# Altium schematic sheet P03_Power Supplies.SchDoc
size C; SheetNumber: 3; SheetTotal: 6
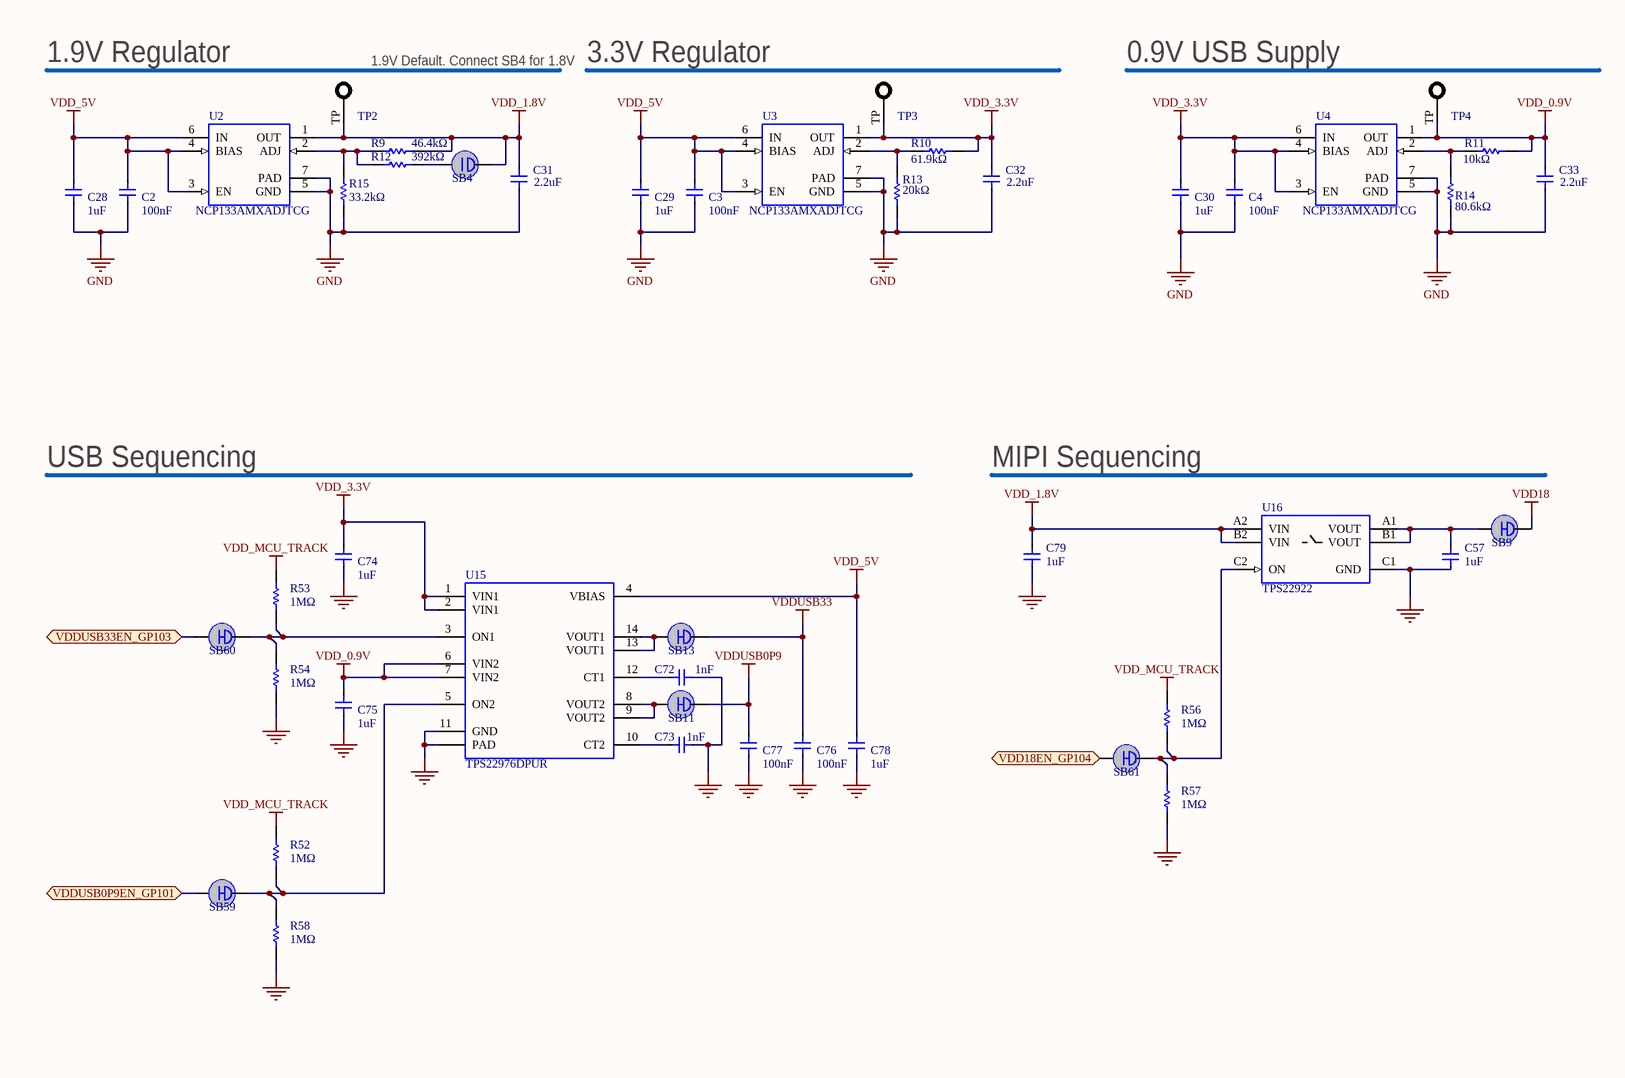
[diagram p0: P03_Power Supplies.SchDoc, left]
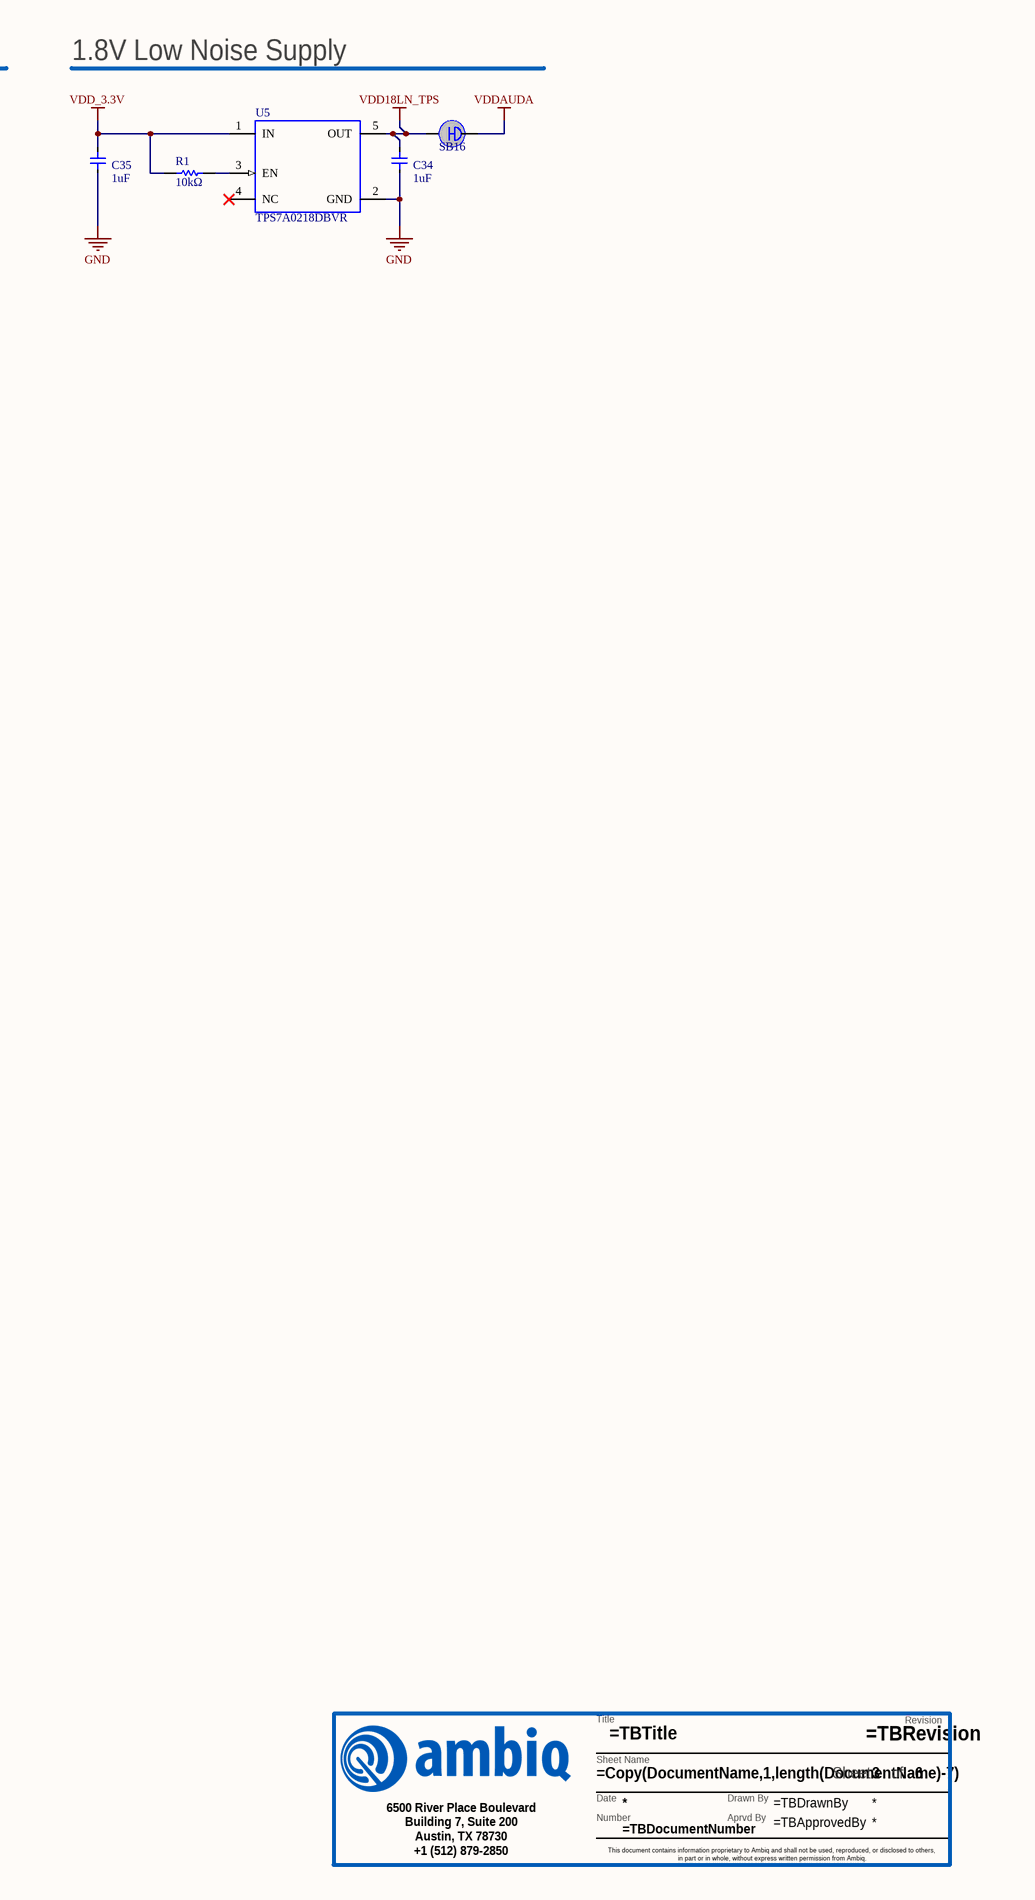
[diagram p1: P03_Power Supplies.SchDoc, right]

## Parts
?  TitleBlock  (value not drawn)  (graphical)
C2  100nF  [IPC_C]
C3  100nF  [IPC_C]
C4  100nF  [IPC_C]
C28  1uF  [IPC_C]
C29  1uF  [IPC_C]
C30  1uF  [IPC_C]
C31  2.2uF  [IPC_C]
C32  2.2uF  [IPC_C]
C33  2.2uF  [IPC_C]
C34  1uF  [IPC_C]
C35  1uF  [IPC_C]
C57  1uF  [IPC_A]
C72  1nF  [IPC_C]
C73  1nF  [IPC_C]
C74  1uF  [IPC_C]
C75  1uF  [IPC_C]
C76  100nF  [IPC_C]
C77  100nF  [IPC_C]
C78  1uF  [IPC_C]
C79  1uF  [IPC_A]
R1  10kΩ  [IPC_C]
R9  46.4kΩ  [IPC_C]
R10  61.9kΩ  [IPC_C]
R11  10kΩ  [IPC_C]
R12  392kΩ  [IPC_C]
R13  20kΩ  [IPC_C]
R14  80.6kΩ  [IPC_C]
R15  33.2kΩ  [IPC_C]
R52  1MΩ  [IPC_C]
R53  1MΩ  [IPC_C]
R54  1MΩ  [IPC_C]
R56  1MΩ  [IPC_C]
R57  1MΩ  [IPC_C]
R58  1MΩ  [IPC_C]
SB4  SBO  [SB39X18]  (value not drawn)  (no BOM)
SB9  Solder short  [SB39X18_SHORTED]  (value not drawn)  (net tie, no BOM)
SB11  Solder short  [SB39X18_SHORTED]  (value not drawn)  (net tie, no BOM)
SB13  Solder short  [SB39X18_SHORTED]  (value not drawn)  (net tie, no BOM)
SB16  SBS  [SB39X18_SHORTED]  (value not drawn)  (net tie, no BOM)
SB59  Solder short  [SB39X18_SHORTED]  (value not drawn)  (net tie, no BOM)
SB60  Solder short  [SB39X18_SHORTED]  (value not drawn)  (net tie, no BOM)
SB61  Solder short  [SB39X18_SHORTED]  (value not drawn)  (net tie, no BOM)
TP2  Blue Ring  [5117]  (value not drawn)
TP3  Blue Ring  [5117]  (value not drawn)
TP4  Blue Ring  [5117]  (value not drawn)
U2  NCP133AMXADJTCG  [SON40P120X45_HS-7N]
U3  NCP133AMXADJTCG  [SON40P120X45_HS-7N]
U4  NCP133AMXADJTCG  [SON40P120X45_HS-7N]
U5  TPS7A0218DBVR  [SOT95P280X145-5N]
U15  TPS22976DPUR  [R-PWSON50P300x200-N14]
U16  TPS22922  [BGA6C50P2X3_90X140X55]

## Ports
VDD18EN_GP104 (bidir), VDDUSB0P9EN_GP101 (bidir), VDDUSB33EN_GP103 (bidir)

## Nets
GND: C2.2 C3.2 C4.2 C28.2 C29.2 C30.2 C31.2 C32.2 C33.2 C34.2 C35.2 C57.2 C72.2 C73.2 C74.2 C75.2 C76.2 C77.2 C78.2 C79.2 R13.2 R14.1 R15.1 R54.1 R57.1 R58.1 U2.5(GND) U2.7(PAD) U3.5(GND) U3.7(PAD) U4.5(GND) U4.7(PAD) U5.2(GND) U15.11(GND) U15.PAD U16.C1(GND)
VDD18: SB9.2
VDD18LN_TPS: C34.1 SB16.1 U5.5(OUT)
VDD_0.9V: C33.1 C75.1 R11.2 TP4.TP U4.1(OUT) U15.6(VIN2) U15.7(VIN2)
VDD_1.8V: C31.1 C79.1 R9.2 SB4.2 TP2.TP U2.1(OUT) U16.A2(VIN) U16.B2(VIN)
VDD_3.3V: C4.1 C30.1 C32.1 C35.1 C74.1 R1.2 R10.2 TP3.TP U3.1(OUT) U4.3(EN) U4.4(BIAS) U4.6(IN) U5.1(IN) U15.1(VIN1) U15.2(VIN1)
VDD_5V: C2.1 C3.1 C28.1 C29.1 C78.1 U2.3(EN) U2.4(BIAS) U2.6(IN) U3.3(EN) U3.4(BIAS) U3.6(IN) U15.4(VBIAS)
VDD_MCU_TRACK: R52.2 R53.2 R56.2
VDDAUDA: SB16.2
VDDUSB0P9: C77.1 SB11.2
VDDUSB33: C76.1 SB13.2
VDD18EN_GP104: SB61.1 ; port VDD18EN_GP104
VDDUSB0P9EN_GP101: SB59.1 ; port VDDUSB0P9EN_GP101
VDDUSB33EN_GP103: SB60.1 ; port VDDUSB33EN_GP103
NetC57_1: C57.1 SB9.1 U16.A1(VOUT) U16.B1(VOUT)
NetC72_1: C72.1 U15.12(CT1)
NetC73_1: C73.1 U15.10(CT2)
NetR1_1: R1.1 U5.3(EN)
NetR9_1: R9.1 R12.2 R15.2 U2.2(ADJ)
NetR10_1: R10.1 R13.1 U3.2(ADJ)
NetR11_1: R11.1 R14.2 U4.2(ADJ)
NetR12_1: R12.1 SB4.1
NetR52_1: R52.1 R58.2 SB59.2 U15.5(ON2)
NetR53_1: R53.1 R54.2 SB60.2 U15.3(ON1)
NetR56_1: R56.1 R57.2 SB61.2 U16.C2(ON)
NetSB11_1: SB11.1 U15.8(VOUT2) U15.9(VOUT2)
NetSB13_1: SB13.1 U15.13(VOUT1) U15.14(VOUT1)

Not connected (* = marked no-connect by the designer): U5 4(NC)*

## Notes on the sheet
- 1.9V Regulator
- (near TP2) 1.9V Default. Connect SB4 for 1.8V
- 3.3V Regulator
- 0.9V USB Supply
- 1.8V Low Noise Supply
- USB Sequencing
- MIPI Sequencing
- (in symbol TitleBlock) Revision; Title; Sheet Name; Sheet; of; Date; Drawn By; Number; Aprvd By; 6500 River Place Boulevard / Building 7, Suite 200 / Austin, TX 78730 / +1 (512) 879-2850; This document contains information proprietary to Ambiq and shall not be used, reproduced, or disclosed to others, / in part or in whole, without express written permission from Ambiq.

## Library data of the parts
? = TitleBlock: Title block for Ambiq Schematics. Please have the following parameters entered in Project>Project Options>Parameters: / TBTitle / TBDocumentNumber / TBRevision / TBDrawnBy / TBApprovedBy; AMBIQ PN: TitleBlock
C2-C4 C76 C77 = 0201ZD104KAT2A: NONE; Manufacturer: Kyocera AVX; Tolerance: 10%; Voltage Rating: 10V; AMBIQ PN: 0201ZD104KAT2A; Supplier 1: Arrow Electronics; Supplier Part Number 1: 0201ZD104KAT2A; Manufacturer Part Number: 0201ZD104KAT2A; RoHS: Yes; Category: Ceramic Capacitors; Stock 1: 105000; Pricing 1: 15000=0.00770, 30000=0.00750, 45000=0.00740, 60000=0.00720, 75000=0.00690, 150000=0.00620 (USD); Mount: Surface Mount; Case/Package: 0201; Case Code (Metric): 0603; Case Code (Imperial): 0201; Min Operating Temperature: -55°C; Max Operating Temperature: 85°C; Capacitance: 100nF; Packaging: Tape and Reel; Voltage Rating (DC): 10V; Series: -; Lead Free: Lead Free; RoHS Compliant: Yes; ComponentLink1URL: http://www.mouser.com/ds/2/40/cx5r-776519.pdf?src-supplier=Mouser; ComponentLink1Description: http://www.mouser.com/ds/2/40/cx5r-776519.pdf?src-supplier=Mouser
C28-C30 C34 C35 C74 C75 C78 = CL05A105MP5NNNC: NONE; Manufacturer: Samsung; Tolerance: 20%; Voltage Rating: 10V; Dielectric: X5R; AMBIQ PN: CL05A105MP5NNNC; Supplier 1: Newark; Supplier Part Number 1: 82AC9187; Manufacturer Part Number: CL05A105MP5NNNC; RoHS: Yes; Category: Ceramic Capacitors; Pricing 1: 50000=0.10000 (USD); Mount: Surface Mount; Case/Package: 0402; Case Code (Metric): 1005; Case Code (Imperial): 0402; Min Operating Temperature: -55°C; Max Operating Temperature: 85°C; Capacitance: 1uF; Packaging: Tape and Reel; Voltage Rating (DC): 10V; Series: CL; Construction: Flat; Length: 1mm; Width: 0.02inch; Height: 0.5mm; Thickness: 0.022inch; Depth: 0.5mm; Radiation Hardening: No; Lead Free: Lead Free; RoHS Compliant: Yes; ComponentLink1URL: https://datasheet.ciiva.com/25802/cl05a105mp5nnnc-25802049.pdf?src-supplier=Digi-Key; ComponentLink1Description: https://datasheet.ciiva.com/25802/cl05a105mp5nnnc-25802049.pdf?src-supplier=Digi-Key; Package Quantity: 1
C31-C33 = CL05A225KP5NNNC: NONE; Manufacturer: Samsung; Tolerance: 10%; Voltage Rating: 10V; AMBIQ PN: CL05A225KP5NNNC; Supplier 1: Arrow Electronics; Supplier Part Number 1: CL05A225KP5NNNC; Manufacturer Part Number: CL05A225KP5NNNC; RoHS: Yes; Category: Ceramic Capacitors; Stock 1: 32414; Pricing 1: 1=0.14620, 10=0.09980, 25=0.09880, 100=0.05200, 250=0.05150, 500=0.03630, 1000=0.02990, 3000=0.02760, 6000=0.02610, 15000=0.023; Mount: Surface Mount; Case/Package: 0402; Case Code (Metric): 1005; Case Code (Imperial): 0402; Min Operating Temperature: -55°C; Max Operating Temperature: 85°C; Capacitance: 2.2uF; Packaging: Tape and Reel; Voltage Rating (DC): 10V; Series: CL; Length: 0.039inch; Width: 0.02inch; Thickness: 0.022inch; RoHS Compliant: Yes; ComponentLink1URL: https://datasheet.ciiva.com/25727/cl05a225kp5nnnc-25727777.pdf?src-supplier=Digi-Key; ComponentLink1Description: https://datasheet.ciiva.com/25727/cl05a225kp5nnnc-25727777.pdf?src-supplier=Digi-Key; Package Quantity: 1
C57 C79 = GRM033R61A105ME15D: NONE; Manufacturer: Murata; Tolerance: 20%; Voltage Rating: 10V; Dielectric: X5R; AMBIQ PN: GRM033R61A105ME15D; Supplier 1: Arrow Electronics; Supplier Part Number 1: GRM033R61A105ME15D; Manufacturer Part Number: GRM033R61A105ME15D; RoHS: Yes; Category: Ceramic Capacitors; Stock 1: 387591; Pricing 1: 1=0.35440, 10=0.26860, 25=0.26600, 50=0.24050, 100=0.18220, 250=0.18020, 500=0.17800, 1000=0.12040, 3000=0.11920, 6000=0.08160,; Mount: Surface Mount; Case/Package: 0201; Case Code (Metric): 0603; Case Code (Imperial): 0201; Min Operating Temperature: -55°C; Max Operating Temperature: 85°C; Capacitance: 1uF; Packaging: Tape and Reel; Voltage Rating (DC): 10V; Length: 0.024inch; Width: 0.012inch; Thickness: 0.015inch; RoHS Compliant: Yes; ComponentLink1URL: http://search.murata.co.jp/Ceramy/image/img/A01X/G101/ENG/GRM033R61A105ME15-01.pdf?src-supplier=Digi-Key; ComponentLink1Description: http://search.murata.co.jp/Ceramy/image/img/A01X/G101/ENG/GRM033R61A105ME15-01.pdf?src-supplier=Digi-Key
C72 C73 = GRM1555C1H102JA01D: NONE; Manufacturer: Murata; Tolerance: 5%; Voltage Rating: 50V; Dielectric: C0G; Dielectric Material: Ceramic; Insulation Resistance: 10GR; Temperature Coefficient: 30ppm/°C; AMBIQ PN: GRM1555C1H102JA01D; Supplier 1: Arrow Electronics; Supplier Part Number 1: GRM1555C1H102JA01D; Manufacturer Part Number: GRM1555C1H102JA01D; RoHS: Yes; Category: Ceramic Capacitors; Stock 1: 3380000; Pricing 1: 10000=0.00710, 20000=0.00680, 30000=0.00660, 50000=0.00590, 100000=0.00470 (USD); Mount: Surface Mount; Case/Package: 0402; Case Code (Metric): 1005; Case Code (Imperial): 0402; Min Operating Temperature: -55°C; Max Operating Temperature: 125°C; Capacitance: 1nF; Packaging: Tape and Reel; Voltage: 50V; Voltage Rating (DC): 50V; Series: GRM; Construction: Flat; Length: 1mm; Width: 0.5mm; Height: 0.5mm; Thickness: 0.022inch; Depth: 0.5mm; Radiation Hardening: No; REACH SVHC: No SVHC; Lead Free: Lead Free; RoHS Compliant: Yes; ComponentLink1URL: https://datasheet.ciiva.com/34302/1855908-34302849.pdf?src-supplier=Jameco; ComponentLink1Description: https://datasheet.ciiva.com/34302/1855908-34302849.pdf?src-supplier=Jameco; Package Quantity: 1; Termination: SMD/SMT; Number of Pins: 2; Material: Ceramic; Size: 0.5mm
R1 R11 = RC0402FR-0710KL: Surface Mount Thick Film Resistor, Rc Series, 10 Kohm, 62.5 Mw, - 1%, 50 V, 0402 [1005 Metric]; Manufacturer: Yageo; Resistance: 10kR; Power Rating: 62.5mW; Voltage Rating: 50V; Max Power Dissipation: 63mW; Temperature Coefficient: 100ppm/°C; AMBIQ PN: RC0402FR-0710KL; Supplier 1: Arrow Electronics; Supplier Part Number 1: RC0402FR-0710KL; Manufacturer Part Number: RC0402FR-0710KL; RoHS: Yes; Category: Chip SMD Resistors; Stock 1: 7776428; Pricing 1: 10000=0.00210 (USD); Case/Package: 0402; Case Code (Metric): 1005; Case Code (Imperial): 0402; Min Operating Temperature: -55°C; Max Operating Temperature: 155°C; Packaging: Tape and Reel; Resistor Type: Thick Film; Number of Terminations: 2; Termination: SMD/SMT; Voltage Rating (DC): 50V; Features: Moisture Resistant; Series: RC; Construction: Rectangular; Length: 1mm; Width: 0.5mm; Height: 0.32mm; Depth: 0.5mm; REACH SVHC: No SVHC; Military Standard: Not; Lead Free: Lead Free; RoHS Compliant: Yes; ComponentLink1URL: https://datasheet.ciiva.com/7660/38568-7660787.pdf?src-supplier=Element14; ComponentLink1Description: https://datasheet.ciiva.com/7660/38568-7660787.pdf?src-supplier=Element14; ComponentLink2URL: https://datasheet.ciiva.com/7849/1686128-7849814.pdf?src-supplier=Element14; ComponentLink2Description: https://datasheet.ciiva.com/7849/1686128-7849814.pdf?src-supplier=Element14; ComponentLink3URL: https://datasheet.ciiva.com/7983/1018594-7983486.pdf?src-supplier=Element14; Tolerance: 1%; Number of Pins: 2; Resistance Tolerance: 1%; Working Voltage: 50V; Lead Pitch: 0.2mm
R9 = ERJ-2RKF4642X: Res Thick Film 0402 46.4K Ohm 1% 1/10W ±100ppm/°C Molded SMD Punched Carrier T/R; Manufacturer: Panasonic; Resistance: 46.4kR; Power Rating: 100mW; Voltage Rating: 50V; AMBIQ PN: ERJ-2RKF4642X; Supplier 1: Arrow Electronics; Supplier Part Number 1: ERJ-2RKF4642X; Manufacturer Part Number: ERJ-2RKF4642X; RoHS: Yes; Category: Chip SMD Resistors; Stock 1: 70000; Pricing 1: 10000=0.00520 (USD); Mount: Surface Mount; Case/Package: 0402; Case Code (Metric): 1005; Case Code (Imperial): 0402; Contact Plating: Tin; Min Operating Temperature: -55°C; Max Operating Temperature: 155°C; Package Quantity: 1; Packaging: Tape and Reel; Resistor Type: Thick Film; Number of Terminations: 2; Termination: SMD/SMT; Max Power Dissipation: 100mW; Temperature Coefficient: 100ppm/°C; Voltage Rating (DC): 50V; Features: Automotive AEC-Q200; Series: ERJ; Technology: THICK FILM; Construction: Rectangular; Length: 1mm; Width: 0.02inch; Height: 0.35mm; Depth: 0.5mm; Radiation Hardening: No; REACH SVHC: Yes; Military Standard: Not; Lead Free: Lead Free; RoHS Compliant: Yes; ComponentLink1URL: https://datasheet.ciiva.com/7870/aoa0000ce2-7870821.pdf?src-supplier=Element14; ComponentLink1Description: https://datasheet.ciiva.com/7870/aoa0000ce2-7870821.pdf?src-supplier=Element14; ComponentLink2URL: https://datasheet.ciiva.com/43467/1678782-43467454.pdf?src-supplier=Farnell; ComponentLink2Description: https://datasheet.ciiva.com/43467/1678782-43467454.pdf?src-supplier=Farnell; ComponentLink3URL: https://datasheet.ciiva.com/46372/1678782-46372975.pdf?src-supplier=Element14; Tolerance: 1%; Resistance Tolerance: 1%
R10 = ERJ-2RKF6192X: Res Thick Film 0402 61.9K Ohm 1% 1/10W +/-100ppm/ßC Molded SMD Punched Carrier T/R; Manufacturer: Panasonic; Resistance: 61.9kR; Power Rating: 100mW; Voltage Rating: 50V; Temperature Coefficient: 100ppm/°C; AMBIQ PN: ERJ-2RKF6192X; Supplier 1: Arrow Electronics; Supplier Part Number 1: ERJ-2RKF6192X; Manufacturer Part Number: ERJ-2RKF6192X; RoHS: Yes; Category: Chip SMD Resistors; Stock 1: 50040; Pricing 1: 1=0.05180, 10=0.02920, 25=0.02020 (USD); Mount: Surface Mount; Case/Package: 0402; Case Code (Metric): 1005; Case Code (Imperial): 0402; Contact Plating: Tin; Min Operating Temperature: -55°C; Max Operating Temperature: 155°C; Package Quantity: 1; Packaging: Tape and Reel; Resistor Type: Thick Film; Number of Terminations: 2; Termination: SMD/SMT; Max Power Dissipation: 100mW; Voltage Rating (DC): 50V; Features: Automotive AEC-Q200; Series: ERJ; Construction: Rectangular; Length: 1mm; Width: 0.02inch; Height: 0.016inch; Depth: 0.5mm; REACH SVHC: No SVHC; Military Standard: Not; Lead Free: Lead Free; RoHS Compliant: Yes; ComponentLink1URL: https://datasheet.ciiva.com/31404/1678782-31404872.pdf?src-supplier=Farnell; ComponentLink1Description: https://datasheet.ciiva.com/31404/1678782-31404872.pdf?src-supplier=Farnell; ComponentLink2URL: https://datasheet.ciiva.com/6201/426256-6201383.pdf?src-supplier=Farnell; ComponentLink2Description: https://datasheet.ciiva.com/6201/426256-6201383.pdf?src-supplier=Farnell; ComponentLink3URL: https://datasheet.ciiva.com/43460/426256-43460335.pdf?src-supplier=Farnell; Tolerance: 1%; Resistance Tolerance: 1%
R12 = CRCW0402392KFKED: Res Thick Film 0402 392K Ohm 1% 1/16W ±100ppm/°C Molded SMD SMD Paper T/R; Manufacturer: Vishay; Resistance: 392kR; Power Rating: 63mW; Voltage Rating: 50V; AMBIQ PN: CRCW0402392KFKED; Supplier 1: Newark; Supplier Part Number 1: 52K7031; Manufacturer Part Number: CRCW0402392KFKED; RoHS: Yes; Category: Chip SMD Resistors; Stock 1: 12021; Pricing 1: 1=0.11000, 25=0.04200, 100=0.01800, 250=0.01700, 500=0.01500, 1000=0.00800 (USD); Mount: Surface Mount; Case/Package: 0402; Weight: 2.3E-05oz; Case Code (Metric): 1005; Case Code (Imperial): 0402; Contact Plating: Tin; Size Code: 0402; Min Operating Temperature: -55°C; Max Operating Temperature: 155°C; Package Quantity: 10; Packaging: Tape and Reel; Resistor Type: Thick Film; Number of Terminations: 2; Termination: SMD/SMT; Max Power Dissipation: 63mW; Temperature Coefficient: 100ppm/°C; Voltage Rating (DC): 50V; Features: Automotive AEC-Q200; Series: CRCW; Technology: THICK FILM; Construction: Rectangular; Length: 1mm; Width: 0.5mm; Height: 0.35mm; Depth: 0.5mm; Radiation Hardening: No; REACH SVHC: Unknown; Military Standard: Not; Lead Free: Lead Free; RoHS Compliant: Yes; ComponentLink1URL: https://datasheet.ciiva.com/11818/0900766b80d98824-11818070.pdf?src-supplier=RSComponents; ComponentLink1Description: https://datasheet.ciiva.com/11818/0900766b80d98824-11818070.pdf?src-supplier=RSComponents; ComponentLink2URL: https://datasheet.ciiva.com/2463/dcrcwe3-2463814.pdf?src-supplier=Digi-Key; ComponentLink2Description: https://datasheet.ciiva.com/2463/dcrcwe3-2463814.pdf?src-supplier=Digi-Key; ComponentLink3URL: https://datasheet.ciiva.com/2463/dcrcwe3-2463815.pdf?src-supplier=Digi-Key; Tolerance: 1%; Resistance Tolerance: 1%; ComponentLink3Description: https://datasheet.ciiva.com/7830/aoa0000ce2-783072; ComponentLink4URL: https://datasheet.ciiva.com/7830/426256-7830974.pd; ComponentLink4Description: https://datasheet.ciiva.com/7830/426256-7830974.pd; ComponentLink5URL: https://datasheet.ciiva.com/43467/1678782-43467480; ComponentLink5Description: https://datasheet.ciiva.com/43467/1678782-43467480; ComponentLink6URL: https://datasheet.ciiva.com/22723/426256-22723902.; ComponentLink6Description: https://datasheet.ciiva.com/22723/426256-22723902.; ComponentLink7URL: https://datasheet.ciiva.com/16778/70260748-1677805; ComponentLink7Description: https://datasheet.ciiva.com/16778/70260748-1677805; ComponentLink8URL: https://datasheet.ciiva.com/16784/70260748-1678419; ComponentLink8Description: https://datasheet.ciiva.com/16784/70260748-1678419; ComponentLink9URL: https://datasheet.ciiva.com/9186/aoa0000ce2-918668; ComponentLink9Description: https://datasheet.ciiva.com/9186/aoa0000ce2-918668; ComponentLink10URL: https://datasheet.ciiva.com/16440/aoa0000ce2-16440; ComponentLink10Description: https://datasheet.ciiva.com/16440/aoa0000ce2-16440; ComponentLink11URL: https://datasheet.ciiva.com/48531/aoa0000ce2-48531; ComponentLink11Description: https://datasheet.ciiva.com/48531/aoa0000ce2-48531; ComponentLink12URL: https://datasheet.ciiva.com/30245/aoa0000ce2-30245; ComponentLink12Description: https://datasheet.ciiva.com/30245/aoa0000ce2-30245
R13 = CRCW040220K0FKED: Res Thick Film 0402 20K Ohm 1% 1/16W ±100ppm/°C Molded SMD Paper T/R; Manufacturer: Vishay; Resistance: 20kR; Power Rating: 63mW; Voltage Rating: 50V; AMBIQ PN: CRCW040220K0FKED; Supplier 1: Newark; Supplier Part Number 1: 24W2083; Manufacturer Part Number: CRCW040220K0FKED; RoHS: Yes; Category: Chip SMD Resistors; Stock 1: 380000; Pricing 1: 1=0.00600, 10000=0.00600 (USD); Mount: Surface Mount; Case/Package: 0402; Weight: 2.3E-05oz; Case Code (Metric): 1005; Case Code (Imperial): 0402; Contact Plating: Tin; Min Operating Temperature: -55°C; Max Operating Temperature: 155°C; Package Quantity: 10; Packaging: Tape and Reel; Resistor Type: Thick Film; Number of Terminations: 2; Termination: SMD/SMT; Max Power Dissipation: 63mW; Temperature Coefficient: 100ppm/°C; Voltage Rating (DC): 50V; Features: Automotive AEC-Q200; Series: CRCW; Technology: THICK FILM; Construction: Rectangular; Length: 1mm; Width: 0.5mm; Height: 0.35mm; Depth: 0.5mm; Radiation Hardening: No; REACH SVHC: Unknown; Military Standard: Not; Lead Free: Lead Free; RoHS Compliant: Yes; ComponentLink1URL: https://datasheet.ciiva.com/11810/0900766b80d98824-11810023.pdf?src-supplier=RSComponents; ComponentLink1Description: https://datasheet.ciiva.com/11810/0900766b80d98824-11810023.pdf?src-supplier=RSComponents; ComponentLink2URL: https://datasheet.ciiva.com/2463/dcrcwe3-2463139.pdf?src-supplier=Digi-Key; ComponentLink2Description: https://datasheet.ciiva.com/2463/dcrcwe3-2463139.pdf?src-supplier=Digi-Key; ComponentLink3URL: https://datasheet.ciiva.com/2463/dcrcwe3-2463140.pdf?src-supplier=Digi-Key; Tolerance: 1%; Number of Pins: 2; Resistance Tolerance: 1%; Working Voltage: 50V
R14 = CRCW040280K6FKED: Res Thick Film 0402 80.6K Ohm 1% 1/16W ±100ppm/°C Molded SMD SMD Paper T/R; Manufacturer: Vishay; Resistance: 80.6kR; Power Rating: 63mW; Voltage Rating: 50V; AMBIQ PN: CRCW040280K6FKED; Supplier 1: Newark; Supplier Part Number 1: 52K7296; Manufacturer Part Number: CRCW040280K6FKED; RoHS: Yes; Category: Chip SMD Resistors; Stock 1: 9653; Pricing 1: 1=0.00500, 25=0.00500, 100=0.00500, 250=0.00500, 500=0.00500, 1000=0.00500 (USD); Case/Package: 0402; Weight: 2.3E-05oz; Case Code (Metric): 1005; Case Code (Imperial): 0402; Contact Plating: Tin; Size Code: 0402; Min Operating Temperature: -55°C; Max Operating Temperature: 155°C; Package Quantity: 10000; Packaging: Tape and Reel; Resistor Type: Thick Film; Number of Terminations: 2; Termination: SMD/SMT; Max Power Dissipation: 63mW; Temperature Coefficient: 100ppm/°C; Voltage Rating (DC): 50V; Features: Automotive AEC-Q200; Series: CRCW; Technology: THICK FILM; Construction: Rectangular; Length: 1mm; Width: 0.5mm; Height: 0.35mm; Depth: 0.5mm; Radiation Hardening: No; REACH SVHC: Unknown; Military Standard: Not; Lead Free: Lead Free; RoHS Compliant: Yes; ComponentLink1URL: https://datasheet.ciiva.com/7816/1697337-7816204.pdf?src-supplier=Element14; ComponentLink1Description: https://datasheet.ciiva.com/7816/1697337-7816204.pdf?src-supplier=Element14; ComponentLink2URL: https://datasheet.ciiva.com/16394/dcrcwe3-16394495.pdf?src-supplier=Future+Electronics; ComponentLink2Description: https://datasheet.ciiva.com/16394/dcrcwe3-16394495.pdf?src-supplier=Future+Electronics; ComponentLink3URL: https://datasheet.ciiva.com/15159/getdatasheetpartid-29248-15159276.pdf?src-supplier=Verical; Tolerance: 1%; Number of Pins: 2; Resistance Tolerance: 1%
R15 = CRCW040233K2FKED: Res Thick Film 0402 33.2K Ohm 1% 1/16W ±100ppm/°C Molded SMD Paper T/R; Manufacturer: Vishay; Resistance: 33.2kR; Power Rating: 63mW; Voltage Rating: 50V; AMBIQ PN: CRCW040233K2FKED; Supplier 1: Newark; Supplier Part Number 1: 42K3471; Manufacturer Part Number: CRCW040233K2FKED; RoHS: Yes; Category: Chip SMD Resistors; Stock 1: 10000; Pricing 1: 1=0.00600, 10000=0.00600 (USD); Mount: Surface Mount; Case/Package: 0402; Weight: 2.3E-05oz; Case Code (Metric): 1005; Case Code (Imperial): 0402; Contact Plating: Tin; Size Code: 0402; Min Operating Temperature: -55°C; Max Operating Temperature: 155°C; Package Quantity: 10; Packaging: Tape and Reel; Resistor Type: Thick Film; Number of Terminations: 2; Termination: SMD/SMT; Max Power Dissipation: 63mW; Temperature Coefficient: 100ppm/°C; Voltage Rating (DC): 50V; Features: Automotive AEC-Q200; Series: CRCW; Technology: THICK FILM; Construction: Rectangular; Length: 1mm; Width: 0.5mm; Height: 0.35mm; Depth: 0.5mm; Radiation Hardening: No; REACH SVHC: Unknown; Military Standard: Not; Lead Free: Lead Free; RoHS Compliant: Yes; ComponentLink1URL: https://datasheet.ciiva.com/11818/0900766b80d98824-11818039.pdf?src-supplier=RSComponents; ComponentLink1Description: https://datasheet.ciiva.com/11818/0900766b80d98824-11818039.pdf?src-supplier=RSComponents; ComponentLink2URL: https://datasheet.ciiva.com/3256/dcrcwe3-3256415.pdf?src-supplier=Avnet; ComponentLink2Description: https://datasheet.ciiva.com/3256/dcrcwe3-3256415.pdf?src-supplier=Avnet; ComponentLink3URL: https://datasheet.ciiva.com/2463/dcrcwe3-2463142.pdf?src-supplier=Digi-Key; Tolerance: 1%; Number of Pins: 2; Resistance Tolerance: 1%
R52-R54 R56-R58 = ERJ-2RKF1004X: RES SMD 1M OHM 1% 1/10W 0402; Manufacturer: Panasonic; Resistance: 1MR; Power Rating: 100mW; Voltage Rating: 50V; Temperature Coefficient: 100ppm/°C; AMBIQ PN: ERJ-2RKF1004X; Supplier 1: Arrow Electronics; Supplier Part Number 1: ERJ-2RKF1004X; Manufacturer Part Number: ERJ-2RKF1004X; RoHS: Yes; Category: Chip SMD Resistors; Stock 1: 330000; Pricing 1: 10000=0.00500, 30000=0.00450, 50000=0.00440, 100000=0.00400 (USD); Mount: Surface Mount; Case/Package: 0402; Weight: 2.8E-05oz; Case Code (Metric): 1005; Case Code (Imperial): 0402; Contact Plating: Tin; Min Operating Temperature: -55°C; Max Operating Temperature: 155°C; Package Quantity: 1; Packaging: Tape and Reel; Resistor Type: Thick Film; Number of Terminations: 2; Termination: SMD/SMT; Max Power Dissipation: 100mW; Voltage Rating (DC): 50V; Features: Automotive AEC-Q200; Series: ERJ; Technology: THICK FILM; Construction: Rectangular; Length: 1mm; Width: 0.02inch; Height: 0.35mm; Depth: 0.5mm; Radiation Hardening: No; REACH SVHC: Yes; Military Standard: Not; Lead Free: Lead Free; RoHS Compliant: Yes; ComponentLink1URL: https://datasheet.ciiva.com/34303/1987046-34303551.pdf; ComponentLink1Description: https://datasheet.ciiva.com/34303/1987046-34303551.pdf; ComponentLink2URL: https://datasheet.ciiva.com/11821/0900766b80f80784-11821229.pdf; ComponentLink2Description: https://datasheet.ciiva.com/11821/0900766b80f80784-11821229.pdf; ComponentLink3URL: https://datasheet.ciiva.com/7909/aoa0000ce2-7909180.pdf; Tolerance: 1%; Number of Pins: 2; Resistance Tolerance: 1%; Working Voltage: 50V
SB4 = SBO: None; AMBIQ PN: SBO
SB9 SB11 SB13 SB16 SB59-SB61 = SBS: None; AMBIQ PN: SBS
TP2-TP4 = 5117: None; Manufacturer: Keystone Electronics; Body Material: PBT; AMBIQ PN: 5117; Supplier 1: Newark; Supplier Part Number 1: 95M2479; Manufacturer Part Number: 5117; RoHS: Yes; Category: Uncategorized; Stock 1: 8464; Pricing 1: 1=0.37200, 10=0.35700, 100=0.26000, 500=0.22900, 1000=0.19700, 2500=0.18400, 10000=0.15500 (USD); Mount: Through Hole,PCB; Material: Nylon,Bronze; Package Quantity: 100; Series: THM; ComponentLink1URL: https://datasheet.ciiva.com/2917/m60-2p60-2917660.pdf?src-supplier=Digi-Key; ComponentLink1Description: https://datasheet.ciiva.com/2917/m60-2p60-2917660.pdf?src-supplier=Digi-Key; Contact Material: Bronze; Contact Plating: Silver; Color: Blue; Packaging: Bulk; Height: 0.3inch; RoHS Compliant: Yes; REACH SVHC: No SVHC; Lead Free: Lead Free; ComponentLink2URL: https://datasheet.ciiva.com/16886/70182825-16886140.pdf?src-supplier=Allied+Electronics; ComponentLink2Description: https://datasheet.ciiva.com/16886/70182825-16886140.pdf?src-supplier=Allied+Electronics; Flammability Rating: UL94 V-0; Number of Pins: 1
U2-U4 = NCP133AMXADJTCG: None; Manufacturer: ON Semiconductor; Output Type: Adjustable; Number of Outputs: 1; Max Output Current: 500mA; Output Voltage: 3.6V; Max Input Voltage: 5.5V; Min Input Voltage: 800mV; Polarity: Positive; Accuracy: 0.5%; Dropout Voltage: 140mV; Min Current Limit: 550mA; Power Supply Rejection Ratio (PSRR): 70dB; AMBIQ PN: NCP133AMXADJTCG; Manufacturer Part Number: NCP133AMXADJTCG; Supplier 1: Arrow Electronics; Supplier Part Number 1: NCP133AMXADJTCG; RoHS: Yes; Category: Voltage Regulators - Linear; Stock 1: 50943; Pricing 1: 1=0.67860, 10=0.59180, 100=0.45310, 250=0.42120, 500=0.35830, 1000=0.28640, 3000=0.26440 (USD); Number of Pins: 6; Contact Plating: Tin,Matte; Min Operating Temperature: -40°C; Max Operating Temperature: 85°C; Package Quantity: 3000; Packaging: Tape and Reel; REACH SVHC: No SVHC; Lead Free: Lead Free; RoHS Compliant: Yes; ComponentLink1URL: https://datasheet.ciiva.com/46403/1863238-46403671.pdf?src-supplier=Element14; ComponentLink1Description: https://datasheet.ciiva.com/46403/1863238-46403671.pdf?src-supplier=Element14; Mount: Surface Mount; Length: 1.2mm; Width: 1.2mm; Height: 0.4mm; Output Current: 500mA; Min Output Voltage: 800mV; Reference Voltage: 800mV; Max Output Voltage: 3.6V; Number of Regulators: 1
U5 = TPS7A0218DBVR: None; Manufacturer: Texas Instruments; AMBIQ PN: TPS7A0218DBVR; Manufacturer Part Number: TPS7A0218DBVR; Supplier 1: Mouser; Supplier Part Number 1: 595-TPS7A0218DBVR; RoHS: No; Category: Voltage Regulators - Linear; Stock 1: 2935; Pricing 1: 1=1.58000, 10=1.42000, 25=1.35000, 50=1.35000, 100=1.11000, 250=1.04000, 500=0.91300, 1000=0.72100, 3000=0.69600, 10000=0.69600
U15 = TPS22976DPUT: None; Manufacturer: Texas Instruments; Max Supply Voltage: 6V; Min Supply Voltage: 2.3V; Interface: On/Off; Output Type: Adjustable; Number of Outputs: 2; Max Output Current: 6A; Fault Protection: Over Temperature; Output Configuration: High Side; Output Current: 1A; Output Voltage: 5V; Quiescent Current: 220uA; Polarity: Positive; Accuracy: 0.5%; Dropout Voltage: 250mV; Input Bias Current: 120uA; Min Output Voltage: 800mV; Reference Voltage: 410mV; AMBIQ PN: TPS22976DPUT; Manufacturer Part Number: TPS22976DPUT; Supplier 1: Arrow Electronics; Supplier Part Number 1: TPS22976DPUT; RoHS: Yes; Category: Power Management ICs; Stock 1: 250; Pricing 1: 1=0.70530, 10=0.67280, 25=0.64030, 100=0.60770, 250=0.57510 (USD); Number of Pins: 14; Min Operating Temperature: -40°C; Max Operating Temperature: 105°C; Package Quantity: 4000; Packaging: Tape and Reel; REACH SVHC: No SVHC; Lead Free: Lead Free; RoHS Compliant: Yes; ComponentLink1URL: http://www.ti.com/general/docs/suppproductinfo.tsp?distId=10&amp;gotoUrl=http%3A%2F%2Fwww.ti.com%2Flit%2Fgpn%2Ftps22976&src-sup; ComponentLink1Description: http://www.ti.com/general/docs/suppproductinfo.tsp?distId=10&amp;gotoUrl=http%3A%2F%2Fwww.ti.com%2Flit%2Fgpn%2Ftps22976&src-sup; ComponentLink2URL: https://datasheet.ciiva.com/41458/001085984-da-01-en-ic-reg-ld-mcp1826t-adje-dc-sot-223-5-mcp-41458757.pdf?src-supplier=Conrad; ComponentLink2Description: https://datasheet.ciiva.com/41458/001085984-da-01-en-ic-reg-ld-mcp1826t-adje-dc-sot-223-5-mcp-41458757.pdf?src-supplier=Conrad; Length: 0.257inch; Width: 0.14inch; Height: 0.065inch; Radiation Hardening: No; Number of Channels: 2; Max Input Voltage: 6V; Min Input Voltage: 2.3V; Output Voltage Accuracy: 0.5%; Max Output Voltage: 5V; Termination: SMD/SMT; Halogen Free: Halogen Free
U16 = TPS22922YFPR: None; Manufacturer: Texas Instruments; Interface: On/Off; Nominal Supply Current: 120nA; Number of Outputs: 1; Max Output Current: 2A; Output Configuration: High Side; Max Power Dissipation: 645mW; On-State Resistance: 45mR; Operating Supply Voltage: 3.6V; Min Input Voltage: 900mV; Quiescent Current: 200nA; Turn-On Delay Time: 45us; Turn-Off Delay Time: 139us; AMBIQ PN: TPS22922YFPR; Manufacturer Part Number: TPS22922YFPR; Supplier 1: Arrow Electronics; Supplier Part Number 1: TPS22922YFPR; RoHS: Yes; Category: Hot Swap Controllers; Stock 1: 2092; Pricing 1: 1=0.96850, 10=0.86300, 25=0.81190, 100=0.66430, 250=0.61530, 500=0.53900, 1000=0.42280 (USD); Number of Pins: 6; Min Operating Temperature: -40°C; Max Operating Temperature: 85°C; Package Quantity: 3000; Packaging: Tape and Reel; Supply Current: 120nA; Series: TPS22922; Lead Free: Lead Free; RoHS Compliant: Yes; ComponentLink1URL: https://datasheet.ciiva.com/15103/getdatasheetpartid-215983-15103996.pdf?src-supplier=Verical; ComponentLink1Description: https://datasheet.ciiva.com/15103/getdatasheetpartid-215983-15103996.pdf?src-supplier=Verical; ComponentLink2URL: https://datasheet.ciiva.com/1962/tps22921-1962551.pdf?src-supplier=Digi-Key; ComponentLink2Description: https://datasheet.ciiva.com/1962/tps22921-1962551.pdf?src-supplier=Digi-Key; Radiation Hardening: No; Output Current: 2A; Power Dissipation: 645mW; Number of Channels: 1; Max Input Voltage: 3.6V; ComponentLink3URL: https://datasheet.ciiva.com/1962/tps22921-1962550.; ComponentLink3Description: https://datasheet.ciiva.com/1962/tps22921-1962550.; ComponentLink4URL: https://datasheet.ciiva.com/1962/tps22921-1962552.; ComponentLink4Description: https://datasheet.ciiva.com/1962/tps22921-1962552.; ComponentLink5URL: https://datasheet.ciiva.com/3233/tps22922b-3233573; ComponentLink5Description: https://datasheet.ciiva.com/3233/tps22922b-3233573